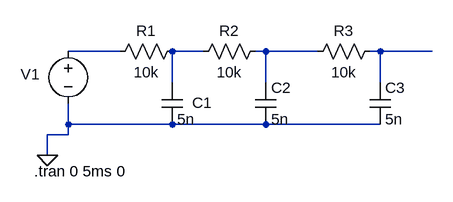
[diagram p0: schematic Draft1.asc]
Draft1.asc, the LTspice schematic file:
Version 4
SHEET 1 880 680
WIRE 80 48 0 48
WIRE 208 48 160 48
WIRE 304 48 288 48
WIRE 384 48 304 48
WIRE 480 48 464 48
WIRE 560 48 480 48
WIRE 160 96 160 48
WIRE 304 96 304 48
WIRE 480 96 480 48
WIRE 0 160 0 128
WIRE 160 160 0 160
WIRE 304 160 160 160
WIRE 480 160 304 160
WIRE 0 176 0 160
WIRE 0 176 -32 176
WIRE -32 208 -32 176
FLAG -32 208 0
SYMBOL voltage 0 32 R0
WINDOW 0 -73 51 Left 2
WINDOW 3 4 116 Invisible 2
WINDOW 123 0 0 Left 2
WINDOW 39 0 0 Left 2
SYMATTR InstName V1
SYMATTR Value PULSE(0 5 0 10n 10n 15u 33u 0)
SYMBOL cap 144 96 R0
WINDOW 0 47 31 Left 2
SYMATTR InstName C1
SYMATTR Value 5n
SYMBOL res 64 64 R270
WINDOW 0 32 56 VTop 2
WINDOW 3 0 56 VBottom 2
SYMATTR InstName R1
SYMATTR Value 10k
SYMBOL res 192 64 R270
WINDOW 0 32 56 VTop 2
WINDOW 3 0 56 VBottom 2
SYMATTR InstName R2
SYMATTR Value 10k
SYMBOL cap 288 96 R0
SYMATTR InstName C2
SYMATTR Value 5n
SYMBOL res 368 64 R270
WINDOW 0 32 56 VTop 2
WINDOW 3 0 56 VBottom 2
SYMATTR InstName R3
SYMATTR Value 10k
SYMBOL cap 464 96 R0
SYMATTR InstName C3
SYMATTR Value 5n
TEXT -52 232 Left 2 !.tran 0 5ms 0

The netlist it stands for:
* Draft1.asc
V1 N001 0 PULSE(0 5 0 10n 10n 15u 33u 0)
C1 N002 0 5n
R1 N001 N002 10k
R2 N002 N003 10k
C2 N003 0 5n
R3 N003 N004 10k
C3 N004 0 5n
.tran 0 5ms 0
.backanno
.end